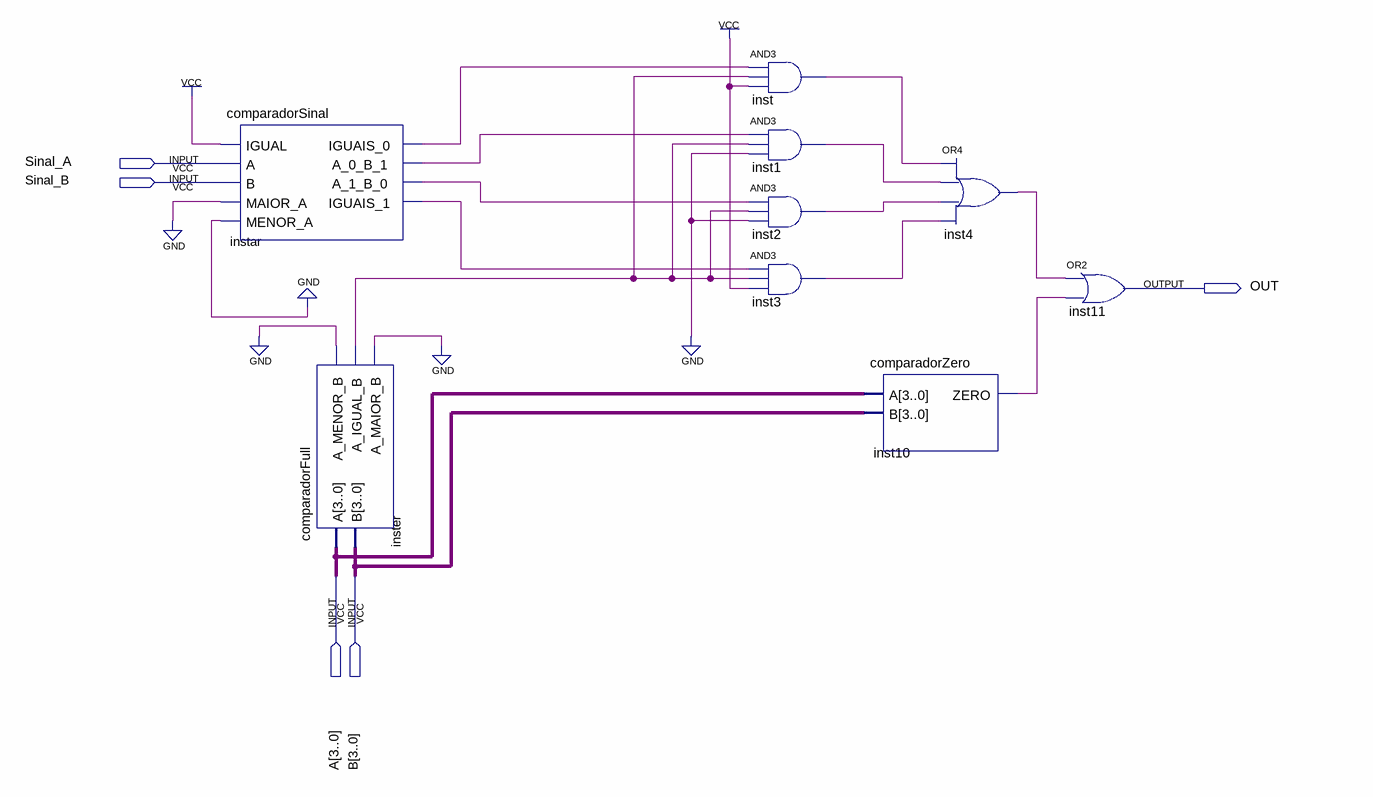
[diagram p0: schematic sheet]
// Quartus schematic comparadorIgual.bdf as structural Verilog: 9 symbols, 5 pins
module comparadorIgual (
  input  Sinal_A,
  input  Sinal_B,
  input  [3:0] A,
  input  [3:0] B,
  output OUT
);

  wire inst1_out, inst2_out, inst3_out, inst4_out, inst10_zero, inst_out, instar_a_0_b_1, instar_a_1_b_0,
       instar_iguais_0, instar_iguais_1, inster_a_igual_b, inster_a_maior_b, inster_a_menor_b;

  comparadorSinal instar (
    .IGUAL(1'b1), .A(Sinal_A), .B(Sinal_B), .MAIOR_A(1'b0), .MENOR_A(1'b0), .IGUAIS_0(instar_iguais_0),
    .A_0_B_1(instar_a_0_b_1), .A_1_B_0(instar_a_1_b_0), .IGUAIS_1(instar_iguais_1));
  comparadorFull inster (
    .A(A), .B(B), .A_MENOR_B(inster_a_menor_b), .A_IGUAL_B(inster_a_igual_b), .A_MAIOR_B(inster_a_maior_b));
  and inst (inst_out, instar_iguais_0, inster_a_igual_b, 1'b1);
  and inst1 (inst1_out, instar_a_0_b_1, inster_a_igual_b, 1'b0);
  and inst2 (inst2_out, instar_a_1_b_0, inster_a_igual_b, 1'b0);
  and inst3 (inst3_out, instar_iguais_1, inster_a_igual_b, 1'b1);
  comparadorZero inst10 (.A(A), .B(B), .ZERO(inst10_zero));
  or inst4 (inst4_out, inst_out, inst1_out, inst2_out, inst3_out);
  or inst11 (OUT, inst4_out, inst10_zero);
  // also tied to GND on the sheet: {inster_a_menor_b, inster_a_maior_b}
endmodule
